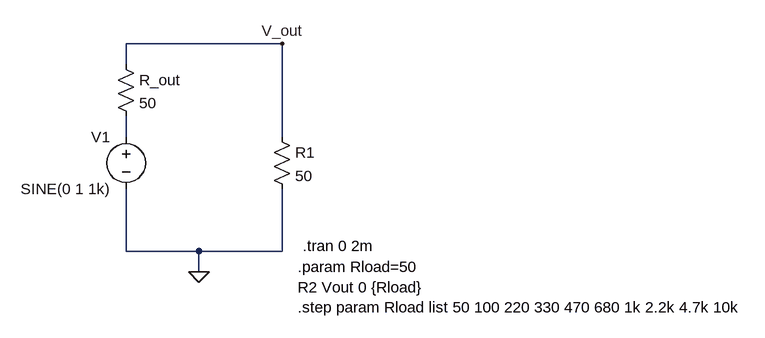
[diagram p0: schematic Lab 1.asc]
Lab 1.asc, the LTspice schematic file:
Version 4
SHEET 1 1128 680
WIRE 384 144 144 144
WIRE 144 176 144 144
WIRE 144 288 144 256
WIRE 384 288 384 144
WIRE 144 464 144 368
WIRE 256 464 144 464
WIRE 384 464 384 368
WIRE 384 464 256 464
WIRE 256 496 256 464
FLAG 256 496 0
FLAG 384 144 V_out
SYMBOL voltage 144 272 M0
SYMATTR InstName V1
SYMATTR Value SINE(0 1 1k)
SYMBOL Res 368 272 R0
SYMATTR InstName R1
SYMATTR Value 50
SYMBOL Res 128 160 R0
SYMATTR InstName R_out
SYMATTR Value 50
TEXT 416 456 Left 2 !.tran 0 2m
TEXT 408 488 Left 2 !.param Rload=50\nR2 Vout 0 {Rload}\n.step param Rload list 50 100 220 330 470 680 1k 2.2k 4.7k 10k

The netlist it stands for:
* Lab 1.asc
V1 N001 0 SINE(0 1 1k)
R1 V_out 0 50
R_out V_out N001 50
.tran 0 2m
.param Rload=50
R2 Vout 0 {Rload}
.step param Rload list 50 100 220 330 470 680 1k 2.2k 4.7k 10k
.backanno
.end